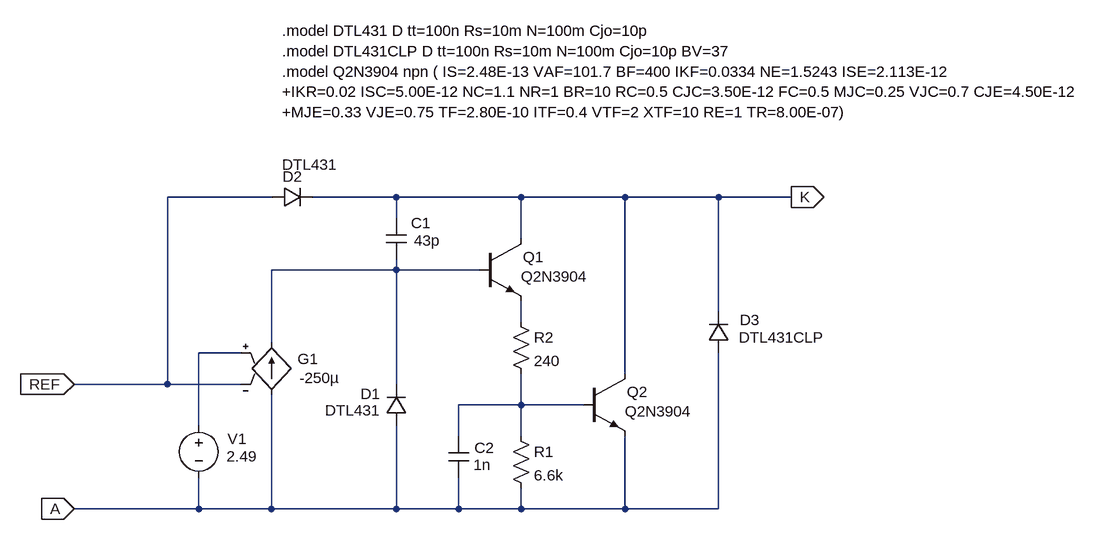
[diagram p0: schematic TL431TOF.asc]
TL431TOF.asc, the LTspice schematic file:
Version 4
SHEET 1 2268 680
WIRE 128 -80 -32 -80
WIRE 320 -80 192 -80
WIRE 512 -80 320 -80
WIRE 672 -80 512 -80
WIRE 816 -80 672 -80
WIRE 928 -80 816 -80
WIRE 320 -48 320 -80
WIRE 512 -16 512 -80
WIRE 320 32 320 16
WIRE 320 32 128 32
WIRE 448 32 320 32
WIRE 816 96 816 -80
WIRE 512 112 512 80
WIRE 128 144 128 32
WIRE 80 160 16 160
WIRE 672 192 672 -80
WIRE -32 208 -32 -80
WIRE -32 208 -176 208
WIRE 80 208 -32 208
WIRE 320 208 320 32
WIRE 512 240 512 192
WIRE 512 240 416 240
WIRE 608 240 512 240
WIRE 16 272 16 160
WIRE 416 288 416 240
WIRE 512 288 512 240
WIRE 16 400 16 352
WIRE 16 400 -176 400
WIRE 128 400 128 224
WIRE 128 400 16 400
WIRE 320 400 320 272
WIRE 320 400 128 400
WIRE 416 400 416 352
WIRE 416 400 320 400
WIRE 512 400 512 368
WIRE 512 400 416 400
WIRE 672 400 672 288
WIRE 672 400 512 400
WIRE 816 400 816 160
WIRE 816 400 672 400
FLAG -176 208 REF
IOPIN -176 208 In
FLAG -176 400 A
IOPIN -176 400 In
FLAG 928 -80 K
IOPIN 928 -80 Out
DATAFLAG -96 208 ""
DATAFLAG 848 -80 ""
SYMBOL g 128 128 R0
WINDOW 0 40 41 Left 2
WINDOW 3 43 70 Left 2
SYMATTR InstName G1
SYMATTR Value -250µ
SYMBOL diode 304 272 M180
WINDOW 0 -39 49 Left 2
WINDOW 3 -94 24 Left 2
SYMATTR InstName D1
SYMATTR Value DTL431
SYMBOL cap 304 -48 R0
WINDOW 0 39 8 Left 2
WINDOW 3 43 35 Left 2
SYMATTR InstName C1
SYMATTR Value 43p
SYMBOL diode 128 -64 R270
WINDOW 0 32 32 VTop 2
WINDOW 3 82 59 VBottom 2
SYMATTR InstName D2
SYMATTR Value DTL431
SYMBOL voltage 16 256 R0
WINDOW 0 44 36 Left 2
WINDOW 3 43 63 Left 2
SYMATTR InstName V1
SYMATTR Value 2.49
SYMBOL res 496 272 R0
SYMATTR InstName R1
SYMATTR Value 6.6k
SYMBOL res 496 96 R0
SYMATTR InstName R2
SYMATTR Value 240
SYMBOL cap 400 288 R0
WINDOW 0 40 18 Left 2
WINDOW 3 39 44 Left 2
SYMATTR InstName C2
SYMATTR Value 1n
SYMBOL npn 448 -16 R0
WINDOW 0 67 28 Left 2
WINDOW 3 64 58 Left 2
SYMATTR InstName Q1
SYMATTR Value Q2N3904
SYMBOL npn 608 192 R0
WINDOW 0 67 28 Left 2
WINDOW 3 64 58 Left 2
SYMATTR InstName Q2
SYMATTR Value Q2N3904
SYMBOL diode 800 160 M180
WINDOW 0 49 51 Left 2
WINDOW 3 47 24 Left 2
SYMATTR InstName D3
SYMATTR Value DTL431CLP
TEXT 144 -336 Left 2 !.model DTL431 D tt=100n Rs=10m N=100m Cjo=10p\n.model DTL431CLP D tt=100n Rs=10m N=100m Cjo=10p BV=37\n.model Q2N3904 npn ( IS=2.48E-13 VAF=101.7 BF=400 IKF=0.0334 NE=1.5243 ISE=2.113E-12 \n+IKR=0.02 ISC=5.00E-12 NC=1.1 NR=1 BR=10 RC=0.5 CJC=3.50E-12 FC=0.5 MJC=0.25 VJC=0.7 CJE=4.50E-12 \n+MJE=0.33 VJE=0.75 TF=2.80E-10 ITF=0.4 VTF=2 XTF=10 RE=1 TR=8.00E-07)

The netlist it stands for:
* TL431TOF.asc
G1 A N001 N003 REF -250µ
D1 A N001 DTL431
C1 K N001 43p
D2 REF K DTL431
V1 N003 A 2.49
R1 N004 A 6.6k
R2 N002 N004 240
C2 N004 A 1n
Q1 K N001 N002 0 Q2N3904
Q2 K N004 A 0 Q2N3904
D3 A K DTL431CLP
.model D D
.lib standard.dio
.model NPN NPN
.model PNP PNP
.lib standard.bjt
.model DTL431 D tt=100n Rs=10m N=100m Cjo=10p
.model DTL431CLP D tt=100n Rs=10m N=100m Cjo=10p BV=37
.model Q2N3904 npn ( IS=2.48E-13 VAF=101.7 BF=400 IKF=0.0334 NE=1.5243 ISE=2.113E-12
+IKR=0.02 ISC=5.00E-12 NC=1.1 NR=1 BR=10 RC=0.5 CJC=3.50E-12 FC=0.5 MJC=0.25 VJC=0.7 CJE=4.50E-12
+MJE=0.33 VJE=0.75 TF=2.80E-10 ITF=0.4 VTF=2 XTF=10 RE=1 TR=8.00E-07)
.backanno
.end